# Altium project UDEMY_ALI_ALCAN.PrjPcb (part 2 of 3)

## Sheet Microcontroller.SchDoc
size A3; ApprovedBy: UDEMY; CheckedBy: Öğrenciler; Revision: AA; SheetNumber: 5; SheetTotal: 6; PageSize: A3; Change Date: 15/09/2023; Rel Date: 15/09/2023; Department: R&D-Hardware; Prepared By: Ali ALCAN; ProjectDescription: Wireless Security Detector
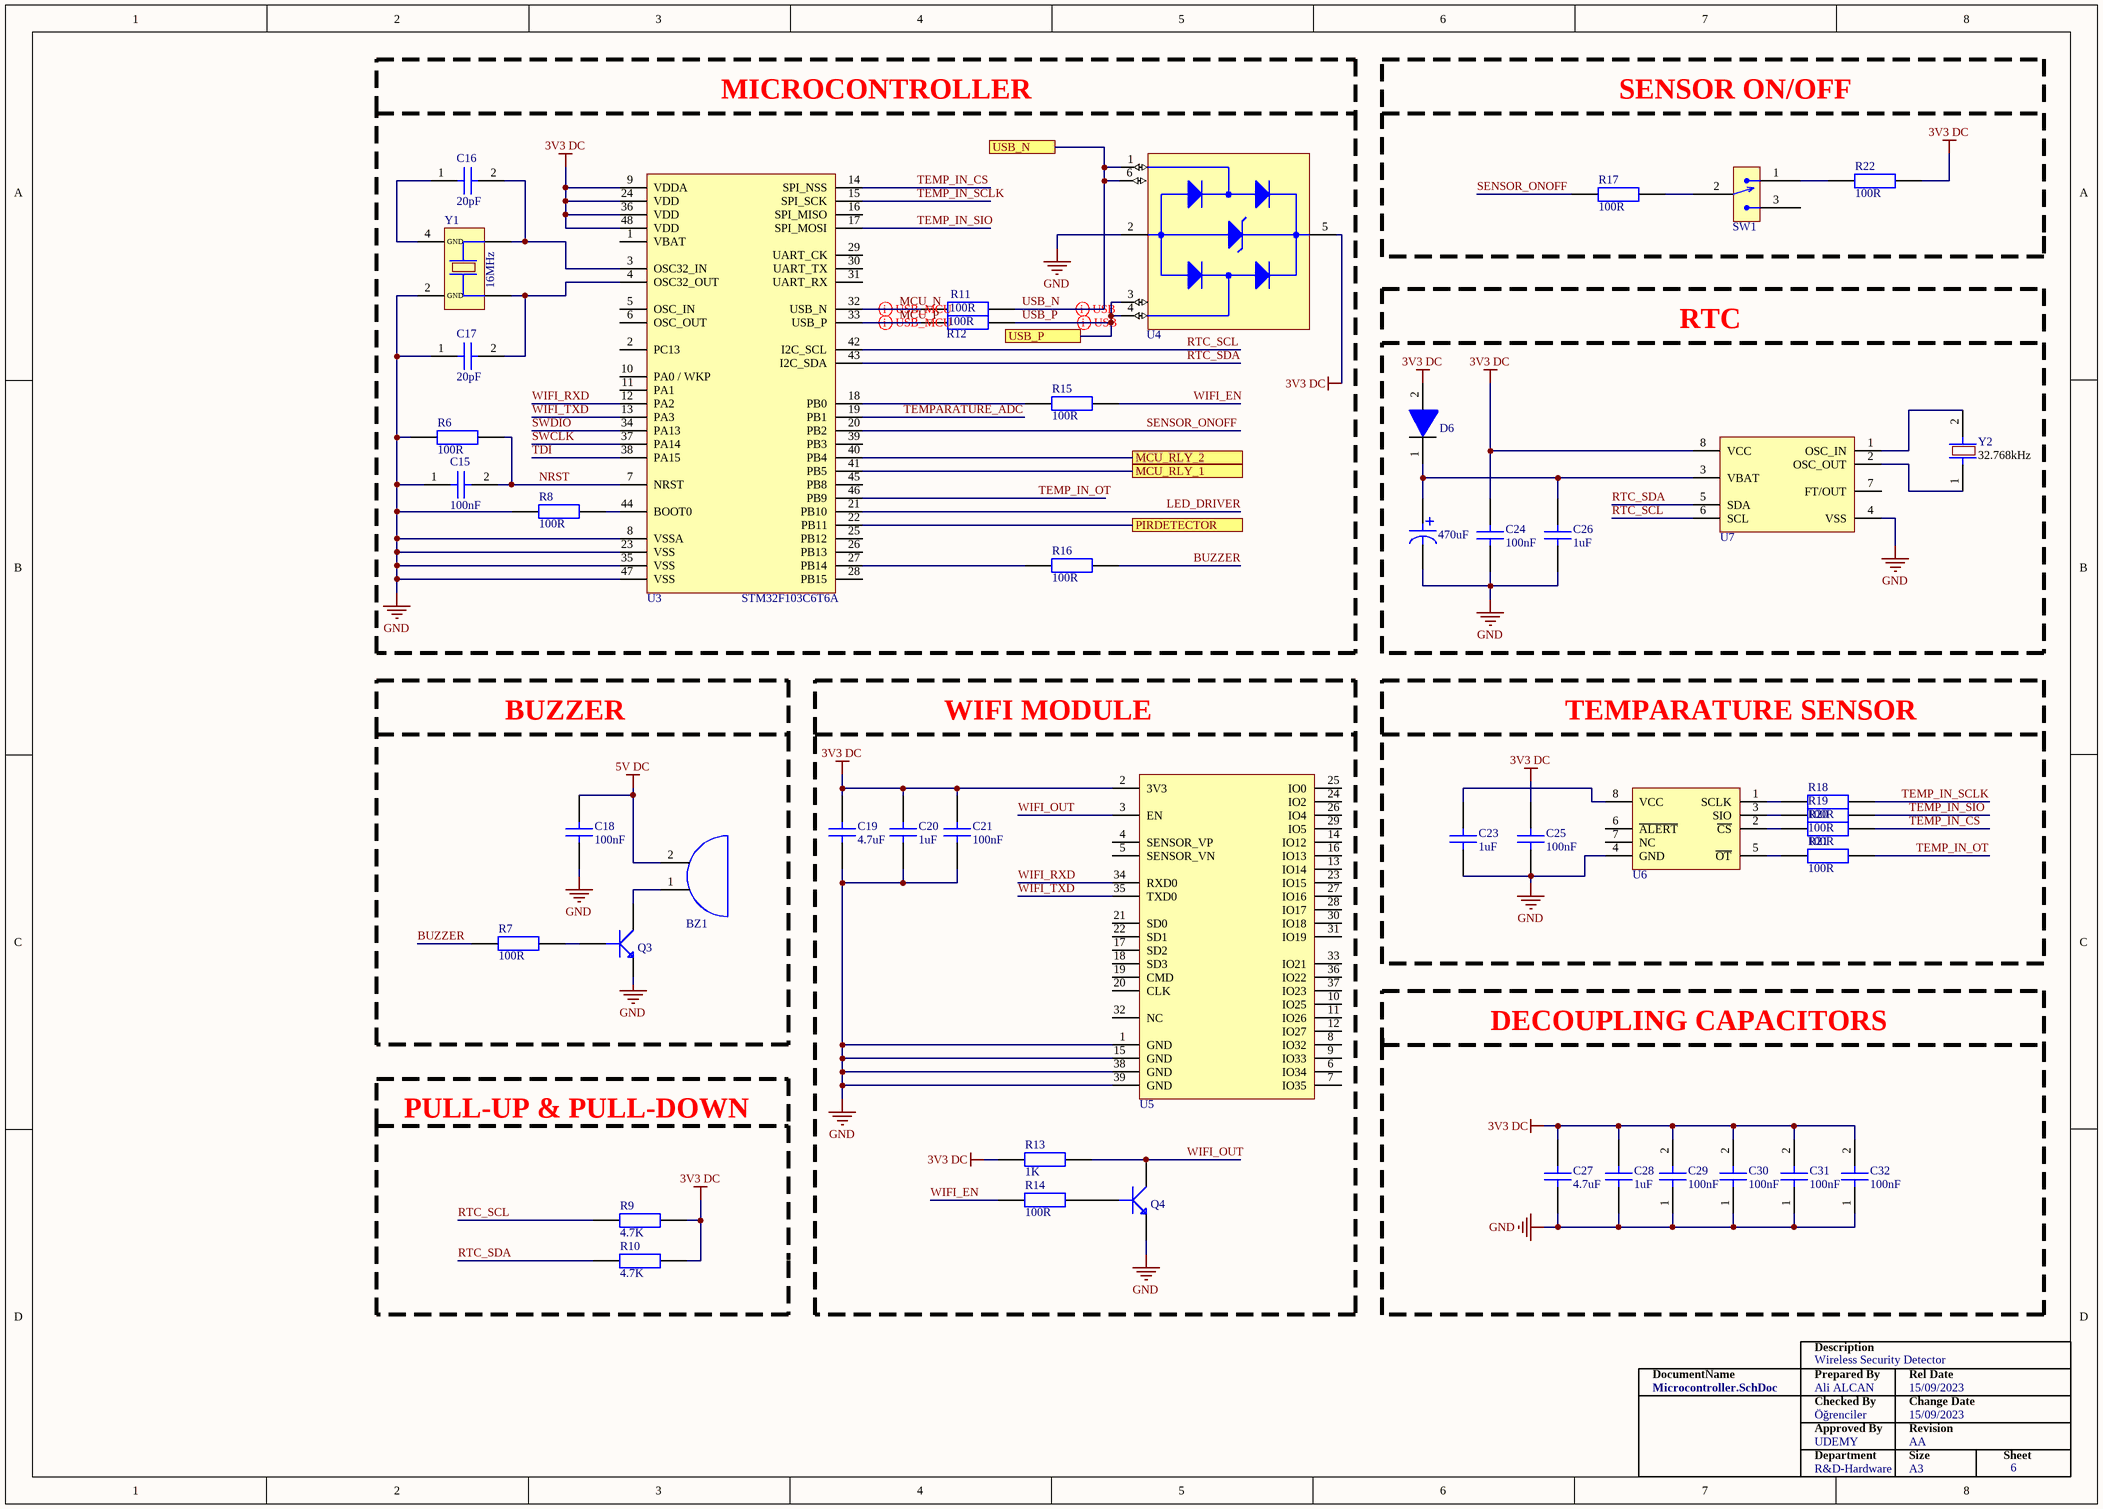
[diagram p3: Microcontroller.SchDoc]

### Parts
BZ1  CMI-9605IC-0580T  [CMI-9605IC]  (value not drawn)
C15  value 100nF  [CAP_0603]  (hidden comment: C0603C104K5RACTU)
C16  value 20pF  [CAP_0603]  (hidden comment: CL10C200JB8NNNC)
C17  value 20pF  [CAP_0603]  (hidden comment: CL10C200JB8NNNC)
C18  value 100nF  [CAP_0805]  (hidden comment: CL21B104KBCNNNC)
C19  value 4.7uF  [CAP_0805]  (hidden comment: CL21A475KAQNNNE)
C20  value 1uF  [CAP_0805]  (hidden comment: CL21B105KBFNNNE)
C21  value 100nF  [CAP_0805]  (hidden comment: CL21B104KBCNNNC)
C22  value 470uF  [CAP_RADIAL_D10_P5]  (hidden comment: ESH477M050AH4AA)
C23  value 1uF  [CAP_0805]  (hidden comment: CL21B105KBFNNNE)
C24  value 100nF  [CAP_0805]  (hidden comment: CL21B104KBCNNNC)
C25  value 100nF  [CAP_0805]  (hidden comment: CL21B104KBCNNNC)
C26  value 1uF  [CAP_0805]  (hidden comment: CL21B105KBFNNNE)
C27  value 4.7uF  [CAP_0805]  (hidden comment: CL21A475KAQNNNE)
C28  value 1uF  [CAP_0805]  (hidden comment: CL21B105KBFNNNE)
C29  value 100nF  [CAP_0603]  (hidden comment: C0603C104K5RACTU)
C30  value 100nF  [CAP_0603]  (hidden comment: C0603C104K5RACTU)
C31  value 100nF  [CAP_0603]  (hidden comment: C0603C104K5RACTU)
C32  value 100nF  [CAP_0603]  (hidden comment: C0603C104K5RACTU)
D6  1N4148WS  [SOD323F]  (value not drawn)
Q3  MMBT3904-7-F  [SOT-23F]  (value not drawn)
Q4  MMBT3904-7-F  [SOT-23F]  (value not drawn)
R6  value 100R  [RES_0603]  (hidden comment: RC0603JR-07100RL)
R7  value 100R  [RES_0603]  (hidden comment: RC0603JR-07100RL)
R8  value 100R  [RES_0603]  (hidden comment: RC0603JR-07100RL)
R9  value 4.7K  [RES_0603]  (hidden comment: RC0603JR-074K7L)
R10  value 4.7K  [RES_0603]  (hidden comment: RC0603JR-074K7L)
R11  value 100R  [RES_0603]  (hidden comment: RC0603JR-07100RL)
R12  value 100R  [RES_0603]  (hidden comment: RC0603JR-07100RL)
R13  value 1K  [RES_0603]  (hidden comment: RC0603JR-071KL)
R14  value 100R  [RES_0603]  (hidden comment: RC0603JR-07100RL)
R15  value 100R  [RES_0603]  (hidden comment: RC0603JR-07100RL)
R16  value 100R  [RES_0603]  (hidden comment: RC0603JR-07100RL)
R17  value 100R  [RES_0603]  (hidden comment: RC0603JR-07100RL)
R18  value 100R  [RES_0603]  (hidden comment: RC0603JR-07100RL)
R19  value 100R  [RES_0603]  (hidden comment: RC0603JR-07100RL)
R20  value 100R  [RES_0603]  (hidden comment: RC0603JR-07100RL)
R21  value 100R  [RES_0603]  (hidden comment: RC0603JR-07100RL)
R22  value 100R  [RES_0603]  (hidden comment: RC0603JR-07100RL)
SW1  EG1215AA  [EG1215AA]  (value not drawn)
U3  STM32F103C6T6A  [LQFP-48]
U4  USBLC6-2SC6  [SOT23-6L]  (value not drawn)
U5  ESP32-WROOM-32  [ESP32-32]  (value not drawn)
U6  MAX6662MSA+  [SOIC8]  (value not drawn)
U7  M41T00M6F  [SOIC8]  (value not drawn)
Y1  Frequency: 16MHz  [ECS]  (hidden comment: ECS-160-20-30B-TR)
Y2  Frequency: 32.768kHz  [ABS05]  (hidden comment: ABS05-32.768KHZ-T)

### Blocks framed on the sheet
SENSOR ON/OFF: R17 R22 SW1
RTC: C22 C24 C26 D6 U7 Y2
BUZZER: BZ1 C18 Q3 R7
WIFI MODULE: C19-C21 Q4 R13 R14 U5
TEMPARATURE SENSOR: C23 C25 R18-R21 U6
DECOUPLING CAPACITORS: C27-C32
PULL-UP & PULL-DOWN: R9 R10

### Ports
MCU_RLY_1 (see Power Management[4A]), MCU_RLY_2 (see Power Management[6A]), PIRDETECTOR (see Power Management[3D]), USB_N (see Power Management[5B]), USB_P (see Power Management[5B])

### Nets
3V3 DC: C19.?2 C20.?2 C21.?2 C24.?2 C25.?2 C27.?2 C28.?2 C29.2 C30.2 C31.2 C32.2 D6.2 R9.2 R10.2 R13.2 R22.2 U3.9(VDDA) U3.24(VDD) U3.36(VDD) U3.48(VDD) U4.5(VBUS) U5.2(3V3) U7.8(VCC)
5V DC: BZ1.2 C18.?2
GND: C15.1 C17.1 C18.?1 C19.?1 C20.?1 C21.?1 C22.2 C23.?1 C24.?1 C25.?1 C26.?1 C27.?1 C28.?1 C29.1 C30.1 C31.1 C32.1 Q3.2(E) Q4.2(E) R6.1 R8.1 U3.8(VSSA) U3.23(VSS) U3.35(VSS) U3.47(VSS) U4.2(GND) U5.1(GND) U5.15(GND) U5.38(GND) U5.39(GND) U6.4(GND) U7.4(VSS) Y1.2(GND)
BUZZER: R7.1 R16.2
LED_DRIVER: U3.21(PB10)
MCU_N: R11.1 U3.32(USB_N)
MCU_P: R12.1 U3.33(USB_P)
NRST: C15.2 R6.2 U3.7(NRST)
RTC_SCL: R9.1 U3.42(I2C_SCL) U7.6(SCL)
RTC_SDA: R10.1 U3.43(I2C_SDA) U7.5(SDA)
SENSOR_ONOFF: R17.1 U3.20(PB2)
SWCLK: U3.37(PA14)
SWDIO: U3.34(PA13)
TDI: U3.38(PA15)
TEMP_IN_CS: R20.2 U3.14(SPI_NSS)
TEMP_IN_OT: R21.2 U3.46(PB9)
TEMP_IN_SCLK: R18.2 U3.15(SPI_SCK)
TEMP_IN_SIO: R19.2 U3.17(SPI_MOSI)
TEMPARATURE_ADC: U3.19(PB1)
USB_N: R11.2 U4.1(I/O1_IN) U4.6(I/O1_OUT) ; port USB_N
USB_P: R12.2 U4.3(I/O2_IN) U4.4(I/O2_OUT) ; port USB_P
WIFI_EN: R14.1 R15.2
WIFI_OUT: Q4.3(C) R13.1 U5.3(EN)
WIFI_RXD: U3.12(PA2) U5.34(RXD0)
WIFI_TXD: U3.13(PA3) U5.35(TXD0)
NetBZ1_1: BZ1.1 Q3.3(C)
NetC16_1: C16.1 Y1.4(GND)
NetC16_2: C16.2 U3.3(OSC32_IN) Y1.3
NetC17_2: C17.2 U3.4(OSC32_OUT) Y1.1
NetC22_1: C22.1 C26.?2 D6.1 U7.3(VBAT)
NetC23_?2: C23.?2 U6.8(VCC)
NetJ6_5: U3.22(PB11) ; port PIRDETECTOR
NetQ3_1: Q3.1(B) R7.2
NetQ4_1: Q4.1(B) R14.2
NetR2_1: U3.41(PB5) ; port MCU_RLY_1
NetR4_1: U3.40(PB4) ; port MCU_RLY_2
NetR8_2: R8.2 U3.44(BOOT0)
NetR15_1: R15.1 U3.18(PB0)
NetR16_1: R16.1 U3.27(PB14)
NetR17_2: R17.2 SW1.2
NetR18_1: R18.1 U6.1(SCLK)
NetR19_1: R19.1 U6.3(SIO)
NetR20_1: R20.1 U6.2(~{CS})
NetR21_1: R21.1 U6.5(~{OT})
NetR22_1: R22.1 SW1.1
NetU7_1: U7.1(OSC_IN) Y2.2
NetU7_2: U7.2(OSC_OUT) Y2.1

Not connected (* = marked no-connect by the designer): SW1 3(2); U3 1(VBAT) 2(PC13) 5(OSC_IN) 6(OSC_OUT) 10(PA0_/_WKP) 11(PA1) 16(SPI_MISO) 25(PB12) 26(PB13) 28(PB15) 29(UART_CK) 30(UART_TX) 31(UART_RX) 39(PB3) 45(PB8); U5 4(SENSOR_VP) 5(SENSOR_VN) 6(IO34) 7(IO35) 8(IO32) 9(IO33) 10(IO25) 11(IO26) 12(IO27) 13(IO14) 14(IO12) 16(IO13) 17(SD2) 18(SD3) 19(CMD) 20(CLK) 21(SD0) 22(SD1) 23(IO15) 24(IO2) 25(IO0) 26(IO4) 27(IO16) 28(IO17) 29(IO5) 30(IO18) 31(IO19) 32(NC) 33(IO21) 36(IO22) 37(IO23); U6 6(~{ALERT}) 7(NC); U7 7(FT/OUT)

### Layout directives
differential pair: MCU_N, MCU_P, USB_N, USB_P

### Notes on the sheet
- MICROCONTROLLER
- DocumentName
- Description
- Prepared By
- Rel Date
- Checked By
- Approved By
- Department
- Size
- Revision
- Change Date
- Sheet

### Library data of the parts
BZ1 = CMI-9605IC-0580T: Buzzers Indicator, Internally Driven Magnetic 5 V 30mA 2.7kHz 80dB @ 5V, 10cm Through Hole PC Pins; Manufacturer: CUI Devices; Designed by: ALİ; Supplier: Digi-Key; Supplier Part Number: 2223-CMI-9605IC-0580T-ND; Manufacturer Part Number: CMI-9605IC-0580T; RoHS: No; Category: Audio Products; Stock: 6002; Pricing: 1=1,43, 10=1,19, 25=1,1016, 50=1,037, 100=0,9745, 500=0,83848, 1000=0,78382, 5000=0,7681 (USD); Case/Package: CMI-9605IC
C15 C29-C32 = CAP CER 100nF 0603: CAP CER 100nF 0603 %10; Manufacturer: KEMET; Manufacturer Part Number: C0603C104K5RECAUTO; Designed by: ALİ; Tolerance: 10%; Voltage Rating: 50V; Material: 4241ConductorMaterial; Dielectric: X7R; Temperature Coefficient: 30ppm/°C; Supplier: Digi-Key; Supplier Part Number: 399-14105-1-ND; Category: Ceramic Capacitors; Stock: 4649; Pricing: 1=0,21, 10=0,144, 50=0,0864, 100=0,073, 500=0,04992, 1000=0,04416 (USD); Mounting Technology: Surface Mount; Case/Package: 0603; Case Code (Imperial): 0603; Case Code (Metric): 1608; Min Operating Temperature: -55°C; Max Operating Temperature: 125°C; Packaging: Cut Tape; Series: C; Ratings: AEC-Q200; RoHS Compliant: Yes; RoHS: Yes; Voltage: 50V; Length: 0.063inch; Width: 0.031inch; Thickness: 0.034inch; Lead Free: 5697LeadFree
C16 C17 = CAP CER 20pF 0603: CAP CER 20pF 0603 %15 SMD; Manufacturer: Samsung; Designed by: ALİ; Supplier: Digi-Key; Supplier Part Number: 1276-1187-6-ND; Manufacturer Part Number: CL10C200JB8NNNC; RoHS: Yes; Category: Ceramic Capacitors; Stock: 413243; Pricing: 1=0,1, 10=0,044, 50=0,0238, 100=0,0194, 500=0,01386, 1000=0,01089 (USD); ComponentLink1URL: https://datasheet.ciiva.com/26877/getdatasheetpartid-640634-26877974.pdf?src-supplier=Verical; ComponentLink1Description: https://datasheet.ciiva.com/26877/getdatasheetpartid-640634-26877974.pdf?src-supplier=Verical; ComponentLink2URL: https://datasheet.ciiva.com/26310/mlcc-catalogdownload2013-eng-26310315.pdf?src-supplier=Distrelec; ComponentLink2Description: https://datasheet.ciiva.com/26310/mlcc-catalogdownload2013-eng-26310315.pdf?src-supplier=Distrelec
C18 C21 C24 C25 = CAP CER 100nF 0805: CAP CER 100nF 0805 %10; Manufacturer: Samsung; Designed by: ALİ; Material: Ceramic; Tolerance: 10%; Dielectric: X7R; Voltage Rating: 50V; Supplier: Digi-Key; Supplier Part Number: 1276-1003-1-ND; Manufacturer Part Number: CL21B104KBCNNNC; RoHS: Yes; Category: Ceramic Capacitors; Stock: 1569480; Pricing: 1=0,1, 10=0,044, 50=0,024, 100=0,0196, 500=0,01404, 1000=0,01103 (USD); Mounting Technology: Surface Mount; Case/Package: 0805; Case Code (Metric): 2012; Case Code (Imperial): 0805; Min Operating Temperature: -55°C; Max Operating Temperature: 125°C; Packaging: Tape and Reel; Voltage: 50V; Voltage Rating (DC): 50V; Series: CL; Construction: Flat; Length: 2mm; Width: 0.049inch; Height: 0.85mm; Depth: 1.25mm; Thickness: 0.037inch; Radiation Hardening: No; Lead Free: Lead Free; RoHS Compliant: Yes; ComponentLink1URL: https://datasheet.ciiva.com/25710/cl21b104kbcnnnc-25710182.pdf?src-supplier=Digi-Key; ComponentLink1Description: https://datasheet.ciiva.com/25710/cl21b104kbcnnnc-25710182.pdf?src-supplier=Digi-Key; ComponentLink2URL: https://datasheet.ciiva.com/29199/454152-da-01-en-vs-kondensator-0805-29199814.pdf?src-supplier=Conrad; ComponentLink2Description: https://datasheet.ciiva.com/29199/454152-da-01-en-vs-kondensator-0805-29199814.pdf?src-supplier=Conrad
C19 C27 = CAP CER 4.7uF 0805: CAP CER 4.7uF 0805 %10; Manufacturer: Samsung; Material: 4241ConductorMaterial; Tolerance: 10%; Voltage Rating: 25V; Dielectric: X5R; Designed by: ALİ; Supplier: Digi-Key; Supplier Part Number: 1276-1244-2-ND; Manufacturer Part Number: CL21A475KAQNNNE; RoHS: Yes; Category: Ceramic Capacitors; Stock: 3903395; Pricing: 2000=0,01856, 4000=0,01698, 10000=0,0158, 14000=0,01501, 50000=0,01303, 100000=0,01077, 200000=0,0105 (USD); Mounting Technology: Surface Mount; Case/Package: 0805; Case Code (Metric): 2012; Case Code (Imperial): 0805; Min Operating Temperature: -55°C; Max Operating Temperature: 85°C; Packaging: Tape and Reel; Voltage Rating (DC): 25V; Series: CL; Construction: Flat; Length: 2mm; Height: 1.25mm; Depth: 1.25mm; Radiation Hardening: No; Lead Free: Lead Free; RoHS Compliant: Yes; ComponentLink1URL: https://datasheet.ciiva.com/25798/cl21a475kaqnnne-25798882.pdf?src-supplier=Digi-Key; ComponentLink1Description: https://datasheet.ciiva.com/25798/cl21a475kaqnnne-25798882.pdf?src-supplier=Digi-Key
C20 C23 C26 C28 = CAP CER 1uF 0805: CAP CER 1uF 0805 %10; Manufacturer: Samsung; Material: 4241ConductorMaterial; Tolerance: 10%; Voltage Rating: 50V; Dielectric: X7R; Designed by: ALİ; Supplier: Digi-Key; Supplier Part Number: 1276-1029-1-ND; Manufacturer Part Number: CL21B105KBFNNNE; RoHS: Yes; Category: Ceramic Capacitors; Stock: 212507; Pricing: 1=0,11, 10=0,079, 50=0,045, 100=0,0373, 500=0,02616, 1000=0,02165 (USD); Mounting Technology: Surface Mount; Case/Package: 0805; Case Code (Metric): 2012; Case Code (Imperial): 0805; Min Operating Temperature: -55°C; Max Operating Temperature: 125°C; Packaging: Tape and Reel; Package Quantity: 1; Voltage: 50V; Series: CL; Construction: Flat; Voltage Rating (DC): 50V; Length: 2mm; Width: 0.049inch; Height: 1.25mm; Thickness: 0.053inch; Depth: 1.25mm; Radiation Hardening: No; RoHS Compliant: Yes; ComponentLink1URL: https://datasheet.ciiva.com/25800/cl21b105kbfnnne-25800291.pdf?src-supplier=Digi-Key; ComponentLink1Description: https://datasheet.ciiva.com/25800/cl21b105kbfnnne-25800291.pdf?src-supplier=Digi-Key; ComponentLink2URL: https://datasheet.ciiva.com/16449/cl21b105kbfnnne-16449003.pdf?src-supplier=Future+Electronics; ComponentLink2Description: https://datasheet.ciiva.com/16449/cl21b105kbfnnne-16449003.pdf?src-supplier=Future+Electronics
C22 = CAP ALU ELEC 470uF 50V: Cap, 470UF, 50V, Alu Elec, Radial; Manufacturer: KEMET; Desiged by: ALİ; Supplier: Digi-Key; Supplier Part Number: 399-15683-ND; Manufacturer Part Number: ESH477M050AH4AA; RoHS: Yes; Stock: 6383; Pricing: 1=0,64, 10=0,455, 50=0,344, 100=0,2997, 500=0,222, 1000=0,1887, 2500=0,1776, 5000=0,1665 (USD); ComponentLink1URL: https://api.kemet.com/component-edge/download/datasheet/ESH477M050AH4AA.pdf?src-supplier=Digi-Key; ComponentLink1Description: https://api.kemet.com/component-edge/download/datasheet/ESH477M050AH4AA.pdf?src-supplier=Digi-Key; ComponentLink2URL: https://datasheet.octopart.com/ESH477M050AH4AA-KEMET-datasheet-130075338.pdf?src-supplier=Newark; ComponentLink2Description: https://datasheet.octopart.com/ESH477M050AH4AA-KEMET-datasheet-130075338.pdf?src-supplier=Newark
D6 = 1N4148WS: Diode, Single, 75V, 150mA, 1V, 4ns; Manufacturer: ON Semiconductor / Fairchild; Designed by: ALİ; Max Reverse Current: 5uA; Max Forward Surge Current (Ifsm): 2A; Supplier: Digi-Key; Supplier Part Number: 1N4148WSFSCT-ND; Manufacturer Part Number: 1N4148WS; RoHS: Yes; Category: Rectifier Diodes; Stock: 1311720; Pricing: 1=0,17, 10=0,159, 100=0,0867, 500=0,05332, 1000=0,03636 (USD); Mounting Technology: Surface Mount; Pins: 2; Weight: 0.0276g; Min Operating Temperature: -55°C; Max Operating Temperature: 150°C; Packaging: Tape and Reel; Forward Current: 150mA; Max Repetitive Reverse Voltage (Vrrm): 75V; Package Quantity: 1; Recovery Time: 4ns; Average Rectified Current: 150mA; Reverse Recovery Time: 4ns; Element Configuration: Single; Reverse Voltage: 75V; Max Reverse Voltage (DC): 75V; Series: -; Length: 1.8mm; Width: 1.35mm; Height: 1mm; Radiation Hardening: No; Reach SVHC Compliant: No; Lead Free: Lead Free; RoHS Compliant: Yes; ComponentLink1URL: https://datasheet.ciiva.com/15208/getdatasheetpartid-127819-15208358.pdf?src-supplier=Verical; ComponentLink1Description: https://datasheet.ciiva.com/15208/getdatasheetpartid-127819-15208358.pdf?src-supplier=Verical; ComponentLink2URL: https://datasheet.ciiva.com/8300/1n914bws-8300360.pdf?src-supplier=Avnet; ComponentLink2Description: https://datasheet.ciiva.com/8300/1n914bws-8300360.pdf?src-supplier=Avnet
Q3 Q4 = MMBT3904-7-F: Transistor General Purpose BJT NPN 40 Volt 0.2A Automotive 3-Pin SOT-23; Manufacturer: Diodes Zetex; Designed by: ALİ; Max Power Dissipation: 300mW; Collector Emitter Voltage (VCEO): 40V; Max Collector Current: 200mA; Collector Base Voltage (VCBO): 60V; Power Dissipation: 350mW; Frequency: 300MHz; hFE Min: 100; Number of Elements: 1; Emitter Base Voltage (VEBO): 6V; Collector Emitter Saturation Voltage: 300mV; Supplier: Digi-Key; Supplier Part Number: MMBT3904-FDICT-ND; Manufacturer Part Number: MMBT3904-7-F; RoHS: Yes; Category: BJTs; Stock: 5948624; Pricing: 1=0,12, 10=0,111, 100=0,0607, 500=0,03732, 1000=0,02545 (USD); Mounting Technology: Surface Mount; Case/Package: SOT-23; Pins: 3; Weight: 0.000282oz; Min Operating Temperature: -55°C; Max Operating Temperature: 150°C; Polarity: NPN; Packaging: Tape and Reel; Voltage Rating (DC): 40V; Package Quantity: 3000; Transition Frequency: 300MHz; Collector Emitter Breakdown Voltage: 40V; Max Breakdown Voltage: 40V; Continuous Collector Current: 200mA; Clock Frequency: 300MHz; Gain Bandwidth Product: 300MHz; Series: Automotive, AEC-Q101; Collector-emitter Voltage-Max: 300mV; Length: 3.05mm; Width: 1.4mm; Height: 1mm; Radiation Hardening: No; Reach SVHC Compliant: No; Lead Free: Lead Free; RoHS Compliant: Yes; ComponentLink1URL: https://datasheet.ciiva.com/11201/ds30036-11201778.pdf?src-supplier=Avnet; ComponentLink1Description: https://datasheet.ciiva.com/11201/ds30036-11201778.pdf?src-supplier=Avnet; ComponentLink2URL: https://datasheet.ciiva.com/15138/getdatasheetpartid-53265-15138780.pdf?src-supplier=Verical; ComponentLink2Description: https://datasheet.ciiva.com/15138/getdatasheetpartid-53265-15138780.pdf?src-supplier=Verical; ComponentLink3URL: https://datasheet.ciiva.com/22711/1915516-22711750.pdf?src-supplier=Element14; ComponentLink3Description: https://datasheet.ciiva.com/22711/1915516-22711750.pdf?src-supplier=Element14; ComponentLink4URL: https://datasheet.ciiva.com/11198/ds30036-11198999.pdf?src-supplier=Avnet; ComponentLink4Description: https://datasheet.ciiva.com/11198/ds30036-11198999.pdf?src-supplier=Avnet; ComponentLink5URL: https://datasheet.ciiva.com/6361/ds30036-6361256.pdf?src-supplier=Digi-Key; ComponentLink5Description: https://datasheet.ciiva.com/6361/ds30036-6361256.pdf?src-supplier=Digi-Key; ComponentLink6URL: https://datasheet.ciiva.com/6361/ds30036-6361254.pdf?src-supplier=Digi-Key; ComponentLink6Description: https://datasheet.ciiva.com/6361/ds30036-6361254.pdf?src-supplier=Digi-Key
R6-R8 R11 R12 R14-R22 = RES 100 OHM 0603: Res Thick Film 0603 100 Ohm 5% 1/10W ±100ppm/°C Molded SMD SMD Paper T/R; Manufacturer: Yageo; Designed by: ALİ; Voltage Rating (DC): 50V; Power Rating: 100mW; Supplier: Digi-Key; Supplier Part Number: 311-100GRCT-ND; Manufacturer Part Number: RC0603JR-07100RL; RoHS: Yes; Category: Chip SMD Resistors; Stock: 872002; Pricing: 1=0,1, 10=0,014, 50=0,0088, 100=0,0073, 500=0,00486, 1000=0,00415 (USD); Case/Package: 0603; Pins: 2; Contact Plating: Tin,Matte; Case Code (Imperial): 0603; Case Code (Metric): 1608; Min Operating Temperature: -55°C; Max Operating Temperature: 155°C; Tolerance: 5%; Temperature Coefficient: 100ppm/°C; Resistor Type: Thick Film; Packaging: Tape and Reel; Voltage Rating: 50V; Termination: SMD/SMT; Features: Moisture Resistant; Series: RC; Max Power Dissipation: 100mW; Number of Terminations: 2; Construction: Rectangular; Resistance Tolerance: 5%; Length: 1.6mm; Width: 0.8mm; Depth: 0.8mm; Lead Free: Lead Free; Reach SVHC Compliant: Unknown; Military Standard: Not; RoHS Compliant: Yes; ComponentLink1URL: https://datasheet.ciiva.com/7746/443971-7746425.pdf?src-supplier=Element14; ComponentLink1Description: https://datasheet.ciiva.com/7746/443971-7746425.pdf?src-supplier=Element14; ComponentLink2URL: https://datasheet.ciiva.com/7746/443971-7746426.pdf?src-supplier=Element14; ComponentLink2Description: https://datasheet.ciiva.com/7746/443971-7746426.pdf?src-supplier=Element14; ComponentLink3URL: https://datasheet.ciiva.com/8883/pyu-rc0603-51-rohs-l-4-8883047.pdf?src-supplier=Avnet; ComponentLink3Description: https://datasheet.ciiva.com/8883/pyu-rc0603-51-rohs-l-4-8883047.pdf?src-supplier=Avnet; ComponentLink4URL: https://datasheet.ciiva.com/15189/getdatasheetpartid-325207-15189846.pdf?src-supplier=Verical; ComponentLink4Description: https://datasheet.ciiva.com/15189/getdatasheetpartid-325207-15189846.pdf?src-supplier=Verical
R9 R10 = RES 4K7 OHM 0603: SMD Chip Resistor, 4.7 kOhm, ± 5%, 100 mW, 0603 [1608 Metric], Thick Film, General Purpose; Manufacturer: Yageo; Designed by: ALİ; Voltage Rating (DC): 50V; Temperature Coefficient: 100ppm/°C; Power Rating: 100mW; Supplier: Digi-Key; Supplier Part Number: 311-4.7KGRCT-ND; Manufacturer Part Number: RC0603JR-074K7L; RoHS: Yes; Category: Chip SMD Resistors; Stock: 7008256; Pricing: 1=0,1, 10=0,014, 50=0,0088, 100=0,0073, 500=0,00486, 1000=0,00415 (USD); Case/Package: 0603; Pins: 2; Case Code (Imperial): 0603; Case Code (Metric): 1608; Min Operating Temperature: -55°C; Max Operating Temperature: 155°C; Resistor Type: Thick Film; Tolerance: 5%; Packaging: Tape and Reel; Voltage Rating: 50V; Termination: SMD/SMT; Features: Moisture Resistant; Max Power Dissipation: 100mW; Number of Terminations: 2; Series: RC; Resistance Tolerance: 5%; Construction: Rectangular; Voltage Rating (AC): 50V; Length: 1.6mm; Width: 0.8mm; Depth: 0.8mm; Reach SVHC Compliant: No; Lead Free: Lead Free; RoHS Compliant: Yes; Military Standard: Not; ComponentLink1URL: https://datasheet.ciiva.com/46412/443971-46412858.pdf?src-supplier=Element14; ComponentLink1Description: https://datasheet.ciiva.com/46412/443971-46412858.pdf?src-supplier=Element14
R13 = RES 1K OHM 0603: SMD Chip Resistor, 1 kOhm, ± 5%, 100 mW, 0603 [1608 Metric], Thick Film, General Purpose; Manufacturer: Yageo; Temperature Coefficient: 100ppm/°C; Voltage Rating (DC): 50V; Power Rating: 100mW; Body Length: 1.6mm; Designed by: *; Supplier: Digi-Key; Supplier Part Number: 311-1.0KGRCT-ND; Manufacturer Part Number: RC0603JR-071KL; RoHS: Yes; Category: Chip SMD Resistors; Stock: 1163860; Pricing: 1=0,1, 10=0,014, 50=0,0088, 100=0,0073, 500=0,00486, 1000=0,00415 (USD); Case/Package: 0603; Pins: 2; Contact Plating: Tin,Matte; Case Code (Imperial): 0603; Case Code (Metric): 1608; Min Operating Temperature: -55°C; Max Operating Temperature: 155°C; Tolerance: 5%; Resistor Type: Thick Film; Packaging: Tape and Reel; Package Quantity: 5000; Voltage Rating: 50V; Termination: SMD/SMT; Series: RC; Resistance Tolerance: 5%; Construction: Rectangular; Max Power Dissipation: 100mW; Number of Terminations: 2; Voltage Rating (AC): 50V; Length: 1.6mm; Width: 0.8mm; Height: 0.45mm; Depth: 0.8mm; Reach SVHC Compliant: No; Lead Free: Lead Free; Military Standard: Not; RoHS Compliant: Yes
SW1 = EG1215AA: Slide Switch, SPDT, 0.025A, 24V, SMD; Manufacturer: E-Switch; Designed by: ALİ; Mechanical Life: 10000Cycles; Switch Function: On-On; Actuator Type: Standard; Switch Travel: 1.5mm; Operating Force: 150gf; Actuator Length: 1.4mm; Supplier: Digi-Key; Supplier Part Number: EG5720CT-ND; Manufacturer Part Number: EG1215AA; RoHS: Yes; Stock: 8007; Pricing: 1=0,99, 10=0,951, 25=0,8884, 100=0,7715, 250=0,702, 500=0,6508, 1000=0,60327 (USD); Mounting Technology: Surface Mount; Min Operating Temperature: -20°C; Max Operating Temperature: 70°C; Throw Configuration: SPDT; Packaging: Cut Tape; Voltage Rating (DC): 24V; Termination: Gull Wing; Electrical Life: 10000Cycles; Series: EG; RoHS Compliant: Yes; ComponentLink1URL: https://media.digikey.com/pdf/Data%20Sheets/E-Switch%20PDFs/EG1215_Series_Ds.pdf?src-supplier=Digi-Key; ComponentLink1Description: https://media.digikey.com/pdf/Data%20Sheets/E-Switch%20PDFs/EG1215_Series_Ds.pdf?src-supplier=Digi-Key; ComponentLink2URL: http://www.farnell.com/datasheets/2645007.pdf?src-supplier=Farnell; ComponentLink2Description: http://www.farnell.com/datasheets/2645007.pdf?src-supplier=Farnell
U3 = STM32F103C6T6A: MCU 32-bit STM32F ARM Cortex M3 RISC 32KB Flash 2.5V/3.3V 48-Pin LQFP Tray; Manufacturer: STMicroelectronics; Number of Timers/Counters: 3; Max Supply Voltage: 3.6V; Interface: I2C,SPI,USART; RAM Size: 10KB; Number of I/Os: 37; Min Supply Voltage: 2V; Data Bus Width: 32b; Clock Frequency: 72MHz; Number of ADC Channels: 10; Designed by: ALİ; SleepMode: OK; Supplier: Digi-Key; Supplier Part Number: 497-11515-ND; Manufacturer Part Number: STM32F103C6T6A; RoHS: Yes; Category: Microcontrollers; Stock: 212; Pricing: 1=6,31, 10=5,669, 25=5,3592, 80=4,64475, 250=4,40656, 500=3,954, 1000=3,40275 (USD); Case/Package: LQFP; Pins: 48; Weight: 0.006409oz; Min Operating Temperature: -40°C; Max Operating Temperature: 85°C; Packaging: Tray; Series: STM32F103C6; Package Quantity: 1500; Memory Format: FLASH; Memory Size: 32KB; Core Architecture: ARM; Length: 7mm; Width: 7mm; Height: 1.4mm; Lead Free: Lead Free; RoHS Compliant: Yes; ComponentLink1URL: https://datasheet.ciiva.com/15122/getdatasheetpartid-69879-15122075.pdf?src-supplier=Verical; ComponentLink1Description: https://datasheet.ciiva.com/15122/getdatasheetpartid-69879-15122075.pdf?src-supplier=Verical; ComponentLink2URL: https://datasheet.ciiva.com/14100/pustm-arm-microcont-stm32f103-en-14100507.pdf?src-supplier=Distrelec; ComponentLink2Description: https://datasheet.ciiva.com/14100/pustm-arm-microcont-stm32f103-en-14100507.pdf?src-supplier=Distrelec
U4 = USB PROTECTION: USBLC6 Series 2 Line 6 V Uni / Bi-Directional ESD Protection - SOT-23-6; Manufacturer: STMicroelectronics; Designed by: ALİ; Direction: Unidirectional,Bidirectional; Value: 3.5pF; Operating Supply Voltage: 1.1V; Number of Channels: 2; Breakdown Voltage: 6V; Clamping Voltage: 17V; Reverse Standoff Voltage: 5.25V; Power Line Protection: Yes; Test Current: 1mA; Max Reverse Leakage Current: 150nA; Peak Pulse Current: 5A; Data Rate: 480Mbps; Number of Elements: 1; Working Voltage: 5V; Supplier: Digi-Key; Supplier Part Number: 497-5235-6-ND; Manufacturer Part Number: USBLC6-2SC6; RoHS: Yes; Category: TVS Diodes; Stock: 113981; Pricing: 1=0,61, 10=0,522, 100=0,3897, 500=0,3062, 1000=0,2366 (USD); Mounting Technology: Surface Mount; Case/Package: SOT-23; Pins: 6; Min Operating Temperature: -40°C; Max Operating Temperature: 125°C; Packaging: Tape and Reel; Package Quantity: 3000; Termination: SMD/SMT; Number of Bidirectional Channels: 2; Min Breakdown Voltage: 6V; ESD Protection: Yes; Leakage Current: 150nA; Series: USB; Reverse Breakdown Voltage: 6V; Polarity: Unidirectional,Bidirectional; Max Breakdown Voltage: 6V; Clamping Voltage-Max: 17V; Length: 3.05mm; Width: 1.75mm; Height: 1.3mm; Depth: 1.75mm; Radiation Hardening: No; Reach SVHC Compliant: No; Lead Free: Lead Free; RoHS Compliant: Yes; ComponentLink1URL: https://datasheet.ciiva.com/1268/1690354-1268384.pdf?src-supplier=Element14; ComponentLink1Description: https://datasheet.ciiva.com/1268/1690354-1268384.pdf?src-supplier=Element14; ComponentLink2URL: https://datasheet.ciiva.com/4508/cd00050750-113117-4508433.pdf?src-supplier=Mouser; ComponentLink2Description: https://datasheet.ciiva.com/4508/cd00050750-113117-4508433.pdf?src-supplier=Mouser; ComponentLink3URL: https://datasheet.ciiva.com/15143/getdatasheetpartid-148465-15143789.pdf?src-supplier=Verical; ComponentLink3Description: https://datasheet.ciiva.com/15143/getdatasheetpartid-148465-15143789.pdf?src-supplier=Verical; ComponentLink4URL: https://datasheet.ciiva.com/16200/cd00050750-16200026.pdf?src-supplier=Future+Electronics; ComponentLink4Description: https://datasheet.ciiva.com/16200/cd00050750-16200026.pdf?src-supplier=Future+Electronics; ComponentLink5URL: https://datasheet.ciiva.com/41444/001184109-da-01-en-ic-esd-protecti-usblc6-2sc6-sot-23-6-stm-41444156.pdf?src-supplier=Conrad; ComponentLink5Description: https://datasheet.ciiva.com/41444/001184109-da-01-en-ic-esd-protecti-usblc6-2sc6-sot-23-6-stm-41444156.pdf?src-supplier=Conrad
U5 = ESP32-WROOM-32: Manufacturer: Espressif Systems; Supply Voltage-Nom: 3V3; Designed by: ALİ; Frequency: 2.5GHz; Data Rate: 150Mbps; Supplier: Digi-Key; RoHS: No; Manufacturer Part Number: ESP32-WROOM-32; Min Operating Temperature: -40; Max Operating Temperature: +85; Packaging: Cut Tape; Case/Package: ESP32-32
U6 = MAX6662MSA+: Temp Sensor Digital Serial (3-Wire, SPI) 8-Pin SOIC N Tube; Manufacturer: Maxim; Designed by: ALİ; Supplier: Digi-Key; Supplier Part Number: MAX6662MSA+-ND; Manufacturer Part Number: MAX6662MSA+; RoHS: Yes; Category: Temperature and Humidity Sensors; Stock: 593; Pricing: 1=4,61, 10=3,454, 25=3,0704, 50=2,9168, 100=2,8401, 500=2,37956, 1000=2,22604 (USD); ComponentLink1URL: https://datasheet.ciiva.com/5299/max6662-89142-5299456.pdf?src-supplier=Mouser; ComponentLink1Description: https://datasheet.ciiva.com/5299/max6662-89142-5299456.pdf?src-supplier=Mouser; ComponentLink2URL: https://datasheet.ciiva.com/3277/max6662-3277979.pdf?src-supplier=Avnet; ComponentLink2Description: https://datasheet.ciiva.com/3277/max6662-3277979.pdf?src-supplier=Avnet; ComponentLink3URL: https://datasheet.ciiva.com/2003/max6662-2003390.pdf?src-supplier=Digi-Key; ComponentLink3Description: https://datasheet.ciiva.com/2003/max6662-2003390.pdf?src-supplier=Digi-Key
U7 = M41T00M6F: Real-time Clocks Clock/Calendar I2C, 2-Wire Serial 70uA @ 2V ~ 5.5V SOIC-8_150mil RoHS; Manufacturer: STMicroelectronics; Designed by: ALİ; Supplier: Digi-Key; Supplier Part Number: 497-4697-1-ND; Manufacturer Part Number: M41T00M6F; RoHS: Yes; Category: Real Time Clocks; Stock: 5170; Pricing: 1=3,96, 10=3,556, 25=3,3616, 100=2,9134, 250=2,76404, 500=2,48016, 1000=2,11425 (USD); ComponentLink1URL: https://datasheet.ciiva.com/7630/1837112-7630077.pdf?src-supplier=Element14; ComponentLink1Description: https://datasheet.ciiva.com/7630/1837112-7630077.pdf?src-supplier=Element14; ComponentLink2URL: https://datasheet.ciiva.com/16213/cd00001542-16213654.pdf?src-supplier=Future+Electronics; ComponentLink2Description: https://datasheet.ciiva.com/16213/cd00001542-16213654.pdf?src-supplier=Future+Electronics; ComponentLink3URL: https://datasheet.ciiva.com/41459/001185345-da-01-en-ic-rtc-srl-512kbit-m41t00m6f-soic-8-stm-41459818.pdf?src-supplier=Conrad; ComponentLink3Description: https://datasheet.ciiva.com/41459/001185345-da-01-en-ic-rtc-srl-512kbit-m41t00m6f-soic-8-stm-41459818.pdf?src-supplier=Conrad; Case/Package: SOIC
Y1 = CRYSTAL16MHz: Crystal 16MHz ±30ppm (Tol) ±50ppm (Stability) 20pF FUND 50Ohm 4-Pin Mini-SMD T/R; Manufacturer: ECS International; Designed by: ALİ; Supplier: Digi-Key; Supplier Part Number: XC1120CT-ND; Manufacturer Part Number: ECS-160-20-30B-TR; RoHS: Yes; Category: Crystals; Stock: 27832; Pricing: 1=0,75, 10=0,628, 50=0,5648, 100=0,5021, 500=0,47702 (USD); ComponentLink1URL: https://datasheet.ciiva.com/853/ecx-53b-853408.pdf?src-supplier=Digi-Key; ComponentLink1Description: https://datasheet.ciiva.com/853/ecx-53b-853408.pdf?src-supplier=Digi-Key; ComponentLink2URL: https://datasheet.ciiva.com/853/ecx-53b-853407.pdf?src-supplier=Digi-Key; ComponentLink2Description: https://datasheet.ciiva.com/853/ecx-53b-853407.pdf?src-supplier=Digi-Key; ComponentLink3URL: https://datasheet.ciiva.com/853/ecx-53b-853406.pdf?src-supplier=Digi-Key; ComponentLink3Description: https://datasheet.ciiva.com/853/ecx-53b-853406.pdf?src-supplier=Digi-Key
Y2 = CRYSTAL 32768kHz: CRYSTAL 32.768kHz ±20ppm Crystal 12.5pF 90 kOhm -40°C ^ 85°C Surface Mount 2-SMD; Manufacturer: Abracon; ESR (Equivalent Series Resistance): 90kR; Designed by: ALİ; Supplier: Digi-Key; Supplier Part Number: 535-11899-1-ND; Manufacturer Part Number: ABS05-32.768KHZ-T; RoHS: Yes; Category: Crystals; Stock: 306128; Pricing: 1=0,72, 10=0,603, 50=0,5426, 100=0,4823, 500=0,4582, 1000=0,38586 (USD); Mounting Technology: Surface Mount; Case/Package: CSMD; Pins: 2; Min Operating Temperature: -40°C; Max Operating Temperature: 85°C; Packaging: Tape and Reel; Frequency Tolerance: 20ppm; Load Capacitance: 12.5pF; Package Quantity: 3000; Tolerance: 20ppm; Termination: SMD/SMT; ESR: 90kR; Series: ABS05; Operating Frequency: 32.768 kHz; Length: 1.6mm; Width: 1mm; Height: 0.5mm; Depth: 1mm; Radiation Hardening: No; Reach SVHC Compliant: No; Lead Free: Lead Free; RoHS Compliant: Yes; ComponentLink1URL: https://datasheet.ciiva.com/23810/abs05-23810480.pdf?src-supplier=Newark; ComponentLink1Description: https://datasheet.ciiva.com/23810/abs05-23810480.pdf?src-supplier=Newark; ComponentLink2URL: https://datasheet.ciiva.com/6728/abs05-6728949.pdf?src-supplier=Digi-Key; ComponentLink2Description: https://datasheet.ciiva.com/6728/abs05-6728949.pdf?src-supplier=Digi-Key; ComponentLink3URL: https://datasheet.ciiva.com/6728/abs05-6728950.pdf?src-supplier=Digi-Key; ComponentLink3Description: https://datasheet.ciiva.com/6728/abs05-6728950.pdf?src-supplier=Digi-Key; ComponentLink4URL: https://datasheet.ciiva.com/16411/abs05-16411149.pdf?src-supplier=Future+Electronics; ComponentLink4Description: https://datasheet.ciiva.com/16411/abs05-16411149.pdf?src-supplier=Future+Electronics